# Altium project Sound.PrjPcb
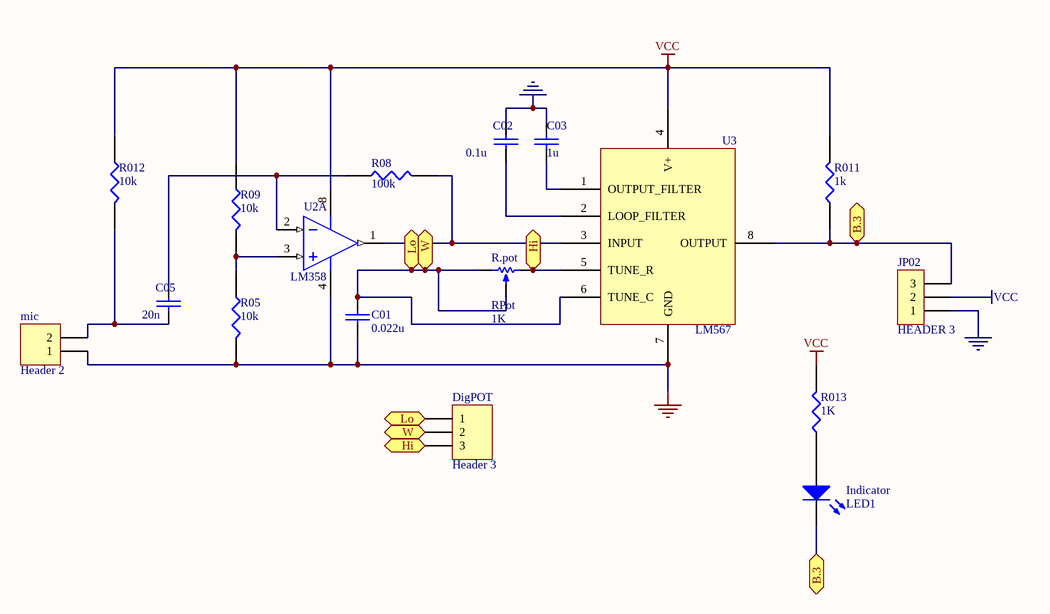
[diagram p0: Sound.SchDoc]
1 sheet, 17 parts. Net scope: flat (ports and power ports of the same name join across sheets).
Board file: Sound.PcbDoc

## Sheet Sound.SchDoc
size B; SheetNumber: 0; SheetTotal: 0

### Parts
C01  0.022u  [RAD-0.1]
C02  0.1u  [RAD-0.1]
C03  1u  [RAD-0.1]
C05  20n  [RAD-0.1]
DigPOT  Header 3  [HDR1X3]
Indicator  LED1  [LED-1]
JP02  HEADER 3  [HDR1X3]
mic  Header 2  [HDR1X2]
R05  10k  [AXIAL-0.3]
R08  100k  [AXIAL-0.3]
R09  10k  [AXIAL-0.3]
R011  1k  [AXIAL-0.3]
R012  10k  [AXIAL-0.3]
R013  1K  [AXIAL-0.3]
R.pot  RPot  value 1K  [VR5]
U2  LM358  [DIP-8]  (part A of 2)
U3  LM567  [DIP-8]

### Ports
B.3, Hi, Lo, W

### Nets
GND: C01.2 C02.1 C03.1 JP02.1 mic.1 R05.2 U2.4(V-) U3.7(GND)
VCC: JP02.2 R09.1 R011.2 R012.1 R013.2 U2.8(V+) U3.4(V+)
NetC01_1: C01.1 DigPOT.1 DigPOT.2 R.pot.1(TOP) R.pot.3(TAP) U3.6(TUNE_C) ; port Lo, port W
NetC02_2: C02.2 U3.2(LOOP_FILTER)
NetC03_2: C03.2 U3.1(OUTPUT_FILTER)
NetC05_1: C05.1 R08.1 U2.2(IN1-)
NetC05_2: C05.2 mic.2 R012.2
NetDigPOT_3: DigPOT.3 R.pot.2(BOT) U3.5(TUNE_R) ; port Hi
NetIndicator_1: Indicator.1(A) R013.1
NetIndicator_2: Indicator.2(K) JP02.3 R011.1 U3.8(OUTPUT) ; port B.3
NetR05_1: R05.1 R09.2 U2.3(IN1+)
NetR08_2: R08.2 U2.1(OUT1) U3.3(INPUT)

### Library data of the parts
C01 C02 C03 C05 = CAP: Capacitor
DigPOT = Header 3: Header, 3-Pin; LatestRevisionDate: 17-Jul-2002; LatestRevisionNote: Re-released for DXP Platform.; Publisher: Altium Limited
Indicator = LED1: Typical RED GaAs LED; Published: 8-Jun-2000; LatestRevisionDate: 08-Jul-2005; LatestRevisionNote: Mech Layer 1 removed.; PackageReference: LED-1; Publisher: Altium Limited
JP02 = CON3: Connector
mic = Header 2: Header, 2-Pin; LatestRevisionDate: 17-Jul-2002; LatestRevisionNote: Re-released for DXP Platform.; Publisher: Altium Limited
R05 R08 R09 R011 R012 R013 = RES1
R.pot = RPot: Potentiometer; Sim Note: Enter the Resistance value and the set point into parameter fields.; Set Position: 0.5; Published: 8-Jun-2000; LatestRevisionDate: 17-Jul-2002; LatestRevisionNote: Re-released for DXP Platform.; PackageReference: VR5; Publisher: Altium Limited
U2 = LM358: Fast Settling Dual Operational Amplifier